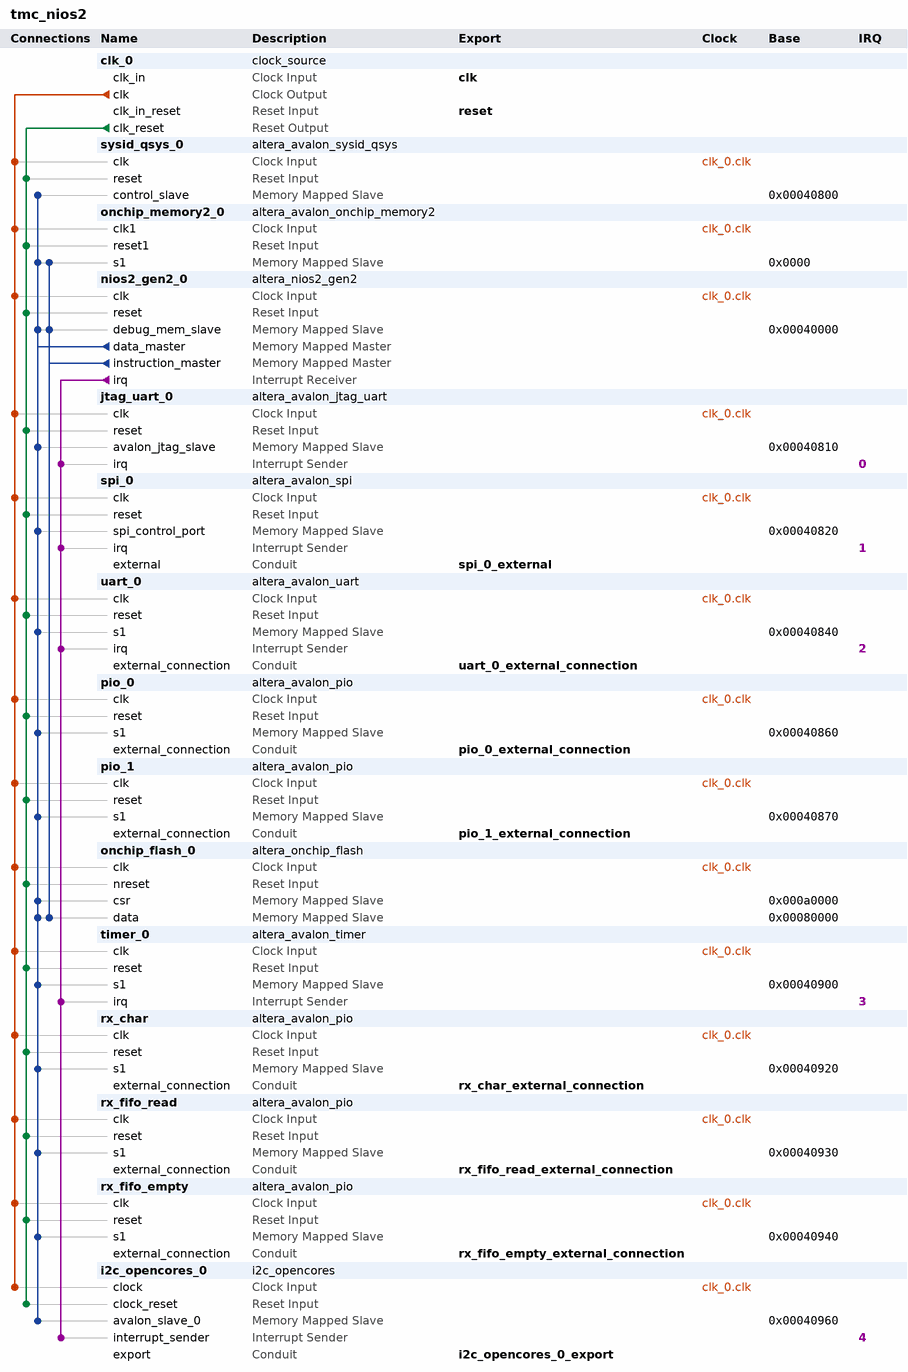
[diagram p0: system contents]
# Platform Designer (Qsys) system tmc_nios2, MAX 10 10M08SAE144C8GES
# Parameters at their usual value, and those the tool derives, are not listed.
package require -exact qsys 15.1
create_system tmc_nios2
set_project_property DEVICE_FAMILY {MAX 10}
set_project_property DEVICE 10M08SAE144C8GES

add_instance clk_0 clock_source 15.1
set_instance_parameter_value clk_0 clockFrequency 50000000

add_instance sysid_qsys_0 altera_avalon_sysid_qsys 15.1
set_instance_parameter_value sysid_qsys_0 id 0

add_instance onchip_memory2_0 altera_avalon_onchip_memory2 15.1
set_instance_parameter_value onchip_memory2_0 dataWidth 32
set_instance_parameter_value onchip_memory2_0 dualPort false
set_instance_parameter_value onchip_memory2_0 initMemContent false
set_instance_parameter_value onchip_memory2_0 initializationFileName onchip_mem.hex
set_instance_parameter_value onchip_memory2_0 memorySize 36250

add_instance nios2_gen2_0 altera_nios2_gen2 15.1
set_instance_parameter_value nios2_gen2_0 dcache_size 65536
set_instance_parameter_value nios2_gen2_0 exceptionSlave onchip_memory2_0.s1
set_instance_parameter_value nios2_gen2_0 icache_size 65536
set_instance_parameter_value nios2_gen2_0 impl Tiny
set_instance_parameter_value nios2_gen2_0 resetSlave onchip_flash_0.data

add_instance jtag_uart_0 altera_avalon_jtag_uart 15.1
set_instance_parameter_value jtag_uart_0 simInteractiveOptions NO_INTERACTIVE_WINDOWS

add_instance spi_0 altera_avalon_spi 15.1
set_instance_parameter_value spi_0 clockPhase 1
set_instance_parameter_value spi_0 clockPolarity 1
set_instance_parameter_value spi_0 dataWidth 8
set_instance_parameter_value spi_0 insertSync true
set_instance_parameter_value spi_0 masterSPI true
set_instance_parameter_value spi_0 numberOfSlaves 12
set_instance_parameter_value spi_0 targetClockRate 50000

add_instance uart_0 altera_avalon_uart 15.1
set_instance_parameter_value uart_0 baud 115200
set_instance_parameter_value uart_0 dataBits 8
set_instance_parameter_value uart_0 fixedBaud true
set_instance_parameter_value uart_0 parity NONE
set_instance_parameter_value uart_0 stopBits 1
set_instance_parameter_value uart_0 useCtsRts true

add_instance pio_0 altera_avalon_pio 15.1
set_instance_parameter_value pio_0 direction Input
set_instance_parameter_value pio_0 width 8

add_instance pio_1 altera_avalon_pio 15.1
set_instance_parameter_value pio_1 direction Output
set_instance_parameter_value pio_1 width 8

add_instance onchip_flash_0 altera_onchip_flash 15.1.1
set_instance_parameter_value onchip_flash_0 CONFIGURATION_MODE {Single Uncompressed Image}
set_instance_parameter_value onchip_flash_0 SECTOR_ACCESS_MODE {Read and write,Read and write,Read only,Hidden,Hidden}
set_instance_parameter_value onchip_flash_0 initFlashContent false
set_instance_parameter_value onchip_flash_0 initializationFileName altera_onchip_flash.hex
set_instance_parameter_value onchip_flash_0 useNonDefaultInitFile false

add_instance timer_0 altera_avalon_timer 15.1
set_instance_parameter_value timer_0 period 6
set_instance_parameter_value timer_0 periodUnits SEC

add_instance rx_char altera_avalon_pio 15.1
set_instance_parameter_value rx_char direction Input
set_instance_parameter_value rx_char width 8

add_instance rx_fifo_read altera_avalon_pio 15.1
set_instance_parameter_value rx_fifo_read direction Output
set_instance_parameter_value rx_fifo_read width 1

add_instance rx_fifo_empty altera_avalon_pio 15.1
set_instance_parameter_value rx_fifo_empty direction Input
set_instance_parameter_value rx_fifo_empty width 1

add_instance i2c_opencores_0 i2c_opencores 13.0

# connections
add_connection clk_0.clk i2c_opencores_0.clock clock
add_connection clk_0.clk jtag_uart_0.clk clock
add_connection clk_0.clk nios2_gen2_0.clk clock
add_connection clk_0.clk onchip_flash_0.clk clock
add_connection clk_0.clk onchip_memory2_0.clk1 clock
add_connection clk_0.clk pio_0.clk clock
add_connection clk_0.clk pio_1.clk clock
add_connection clk_0.clk rx_char.clk clock
add_connection clk_0.clk rx_fifo_empty.clk clock
add_connection clk_0.clk rx_fifo_read.clk clock
add_connection clk_0.clk spi_0.clk clock
add_connection clk_0.clk sysid_qsys_0.clk clock
add_connection clk_0.clk timer_0.clk clock
add_connection clk_0.clk uart_0.clk clock
add_connection clk_0.clk_reset i2c_opencores_0.clock_reset reset
add_connection clk_0.clk_reset jtag_uart_0.reset reset
add_connection clk_0.clk_reset nios2_gen2_0.reset reset
add_connection clk_0.clk_reset onchip_flash_0.nreset reset
add_connection clk_0.clk_reset onchip_memory2_0.reset1 reset
add_connection clk_0.clk_reset pio_0.reset reset
add_connection clk_0.clk_reset pio_1.reset reset
add_connection clk_0.clk_reset rx_char.reset reset
add_connection clk_0.clk_reset rx_fifo_empty.reset reset
add_connection clk_0.clk_reset rx_fifo_read.reset reset
add_connection clk_0.clk_reset spi_0.reset reset
add_connection clk_0.clk_reset sysid_qsys_0.reset reset
add_connection clk_0.clk_reset timer_0.reset reset
add_connection clk_0.clk_reset uart_0.reset reset
add_connection nios2_gen2_0.data_master i2c_opencores_0.avalon_slave_0 avalon
set_connection_parameter_value nios2_gen2_0.data_master/i2c_opencores_0.avalon_slave_0 baseAddress 0x00040960
add_connection nios2_gen2_0.data_master jtag_uart_0.avalon_jtag_slave avalon
set_connection_parameter_value nios2_gen2_0.data_master/jtag_uart_0.avalon_jtag_slave baseAddress 0x00040810
add_connection nios2_gen2_0.data_master nios2_gen2_0.debug_mem_slave avalon
set_connection_parameter_value nios2_gen2_0.data_master/nios2_gen2_0.debug_mem_slave baseAddress 0x00040000
add_connection nios2_gen2_0.data_master onchip_flash_0.csr avalon
set_connection_parameter_value nios2_gen2_0.data_master/onchip_flash_0.csr baseAddress 0x000a0000
add_connection nios2_gen2_0.data_master onchip_flash_0.data avalon
set_connection_parameter_value nios2_gen2_0.data_master/onchip_flash_0.data baseAddress 0x00080000
add_connection nios2_gen2_0.data_master onchip_memory2_0.s1 avalon
set_connection_parameter_value nios2_gen2_0.data_master/onchip_memory2_0.s1 baseAddress 0x0000
add_connection nios2_gen2_0.data_master pio_0.s1 avalon
set_connection_parameter_value nios2_gen2_0.data_master/pio_0.s1 baseAddress 0x00040860
add_connection nios2_gen2_0.data_master pio_1.s1 avalon
set_connection_parameter_value nios2_gen2_0.data_master/pio_1.s1 baseAddress 0x00040870
add_connection nios2_gen2_0.data_master rx_char.s1 avalon
set_connection_parameter_value nios2_gen2_0.data_master/rx_char.s1 baseAddress 0x00040920
add_connection nios2_gen2_0.data_master rx_fifo_empty.s1 avalon
set_connection_parameter_value nios2_gen2_0.data_master/rx_fifo_empty.s1 baseAddress 0x00040940
add_connection nios2_gen2_0.data_master rx_fifo_read.s1 avalon
set_connection_parameter_value nios2_gen2_0.data_master/rx_fifo_read.s1 baseAddress 0x00040930
add_connection nios2_gen2_0.data_master spi_0.spi_control_port avalon
set_connection_parameter_value nios2_gen2_0.data_master/spi_0.spi_control_port baseAddress 0x00040820
add_connection nios2_gen2_0.data_master sysid_qsys_0.control_slave avalon
set_connection_parameter_value nios2_gen2_0.data_master/sysid_qsys_0.control_slave baseAddress 0x00040800
add_connection nios2_gen2_0.data_master timer_0.s1 avalon
set_connection_parameter_value nios2_gen2_0.data_master/timer_0.s1 baseAddress 0x00040900
add_connection nios2_gen2_0.data_master uart_0.s1 avalon
set_connection_parameter_value nios2_gen2_0.data_master/uart_0.s1 baseAddress 0x00040840
add_connection nios2_gen2_0.instruction_master nios2_gen2_0.debug_mem_slave avalon
set_connection_parameter_value nios2_gen2_0.instruction_master/nios2_gen2_0.debug_mem_slave baseAddress 0x00040000
add_connection nios2_gen2_0.instruction_master onchip_flash_0.data avalon
set_connection_parameter_value nios2_gen2_0.instruction_master/onchip_flash_0.data baseAddress 0x00080000
add_connection nios2_gen2_0.instruction_master onchip_memory2_0.s1 avalon
set_connection_parameter_value nios2_gen2_0.instruction_master/onchip_memory2_0.s1 baseAddress 0x0000
add_connection nios2_gen2_0.irq i2c_opencores_0.interrupt_sender interrupt
set_connection_parameter_value nios2_gen2_0.irq/i2c_opencores_0.interrupt_sender irqNumber 4
add_connection nios2_gen2_0.irq jtag_uart_0.irq interrupt
set_connection_parameter_value nios2_gen2_0.irq/jtag_uart_0.irq irqNumber 0
add_connection nios2_gen2_0.irq spi_0.irq interrupt
set_connection_parameter_value nios2_gen2_0.irq/spi_0.irq irqNumber 1
add_connection nios2_gen2_0.irq timer_0.irq interrupt
set_connection_parameter_value nios2_gen2_0.irq/timer_0.irq irqNumber 3
add_connection nios2_gen2_0.irq uart_0.irq interrupt
set_connection_parameter_value nios2_gen2_0.irq/uart_0.irq irqNumber 2

# exported interfaces
add_interface clk clock sink
set_interface_property clk EXPORT_OF clk_0.clk_in
add_interface i2c_opencores_0_export conduit end
set_interface_property i2c_opencores_0_export EXPORT_OF i2c_opencores_0.export
add_interface pio_0_external_connection conduit end
set_interface_property pio_0_external_connection EXPORT_OF pio_0.external_connection
add_interface pio_1_external_connection conduit end
set_interface_property pio_1_external_connection EXPORT_OF pio_1.external_connection
add_interface reset reset sink
set_interface_property reset EXPORT_OF clk_0.clk_in_reset
add_interface rx_char_external_connection conduit end
set_interface_property rx_char_external_connection EXPORT_OF rx_char.external_connection
add_interface rx_fifo_empty_external_connection conduit end
set_interface_property rx_fifo_empty_external_connection EXPORT_OF rx_fifo_empty.external_connection
add_interface rx_fifo_read_external_connection conduit end
set_interface_property rx_fifo_read_external_connection EXPORT_OF rx_fifo_read.external_connection
add_interface spi_0_external conduit end
set_interface_property spi_0_external EXPORT_OF spi_0.external
add_interface uart_0_external_connection conduit end
set_interface_property uart_0_external_connection EXPORT_OF uart_0.external_connection

set_interconnect_requirement {$system} qsys_mm.clockCrossingAdapter HANDSHAKE
set_interconnect_requirement {$system} qsys_mm.enableEccProtection FALSE
set_interconnect_requirement {$system} qsys_mm.insertDefaultSlave FALSE
set_interconnect_requirement {$system} qsys_mm.maxAdditionalLatency 1

save_system tmc_nios2.qsys
